# Altium schematic sheet Logica_ADC.SchDoc: CSN Detector V3
size A4; CheckedBy: RCP; Author: RCP; DrawnBy: RCP; Address1: LIM-HGGM; Address3: RCP; DocumentNumber: 1; Revision: 1; SheetNumber: 3; SheetTotal: 3; PageSetup: Record=PageOptions|CenterHorizontal=True|CenterVertical=True|PrintScale=1.00|XCorrection=1.00|YCorrection=1.00|PrintKind=0|BorderSize=5000000|LeftOffset=0|BottomOffset=0|Orientation=2|PaperLength=1000|PaperWidth=1000|Scale=100|PaperSource=7|PrintQuality=-4|MediaType=1|DitherType=10|PaperKind=A4|PrintScaleMode=1
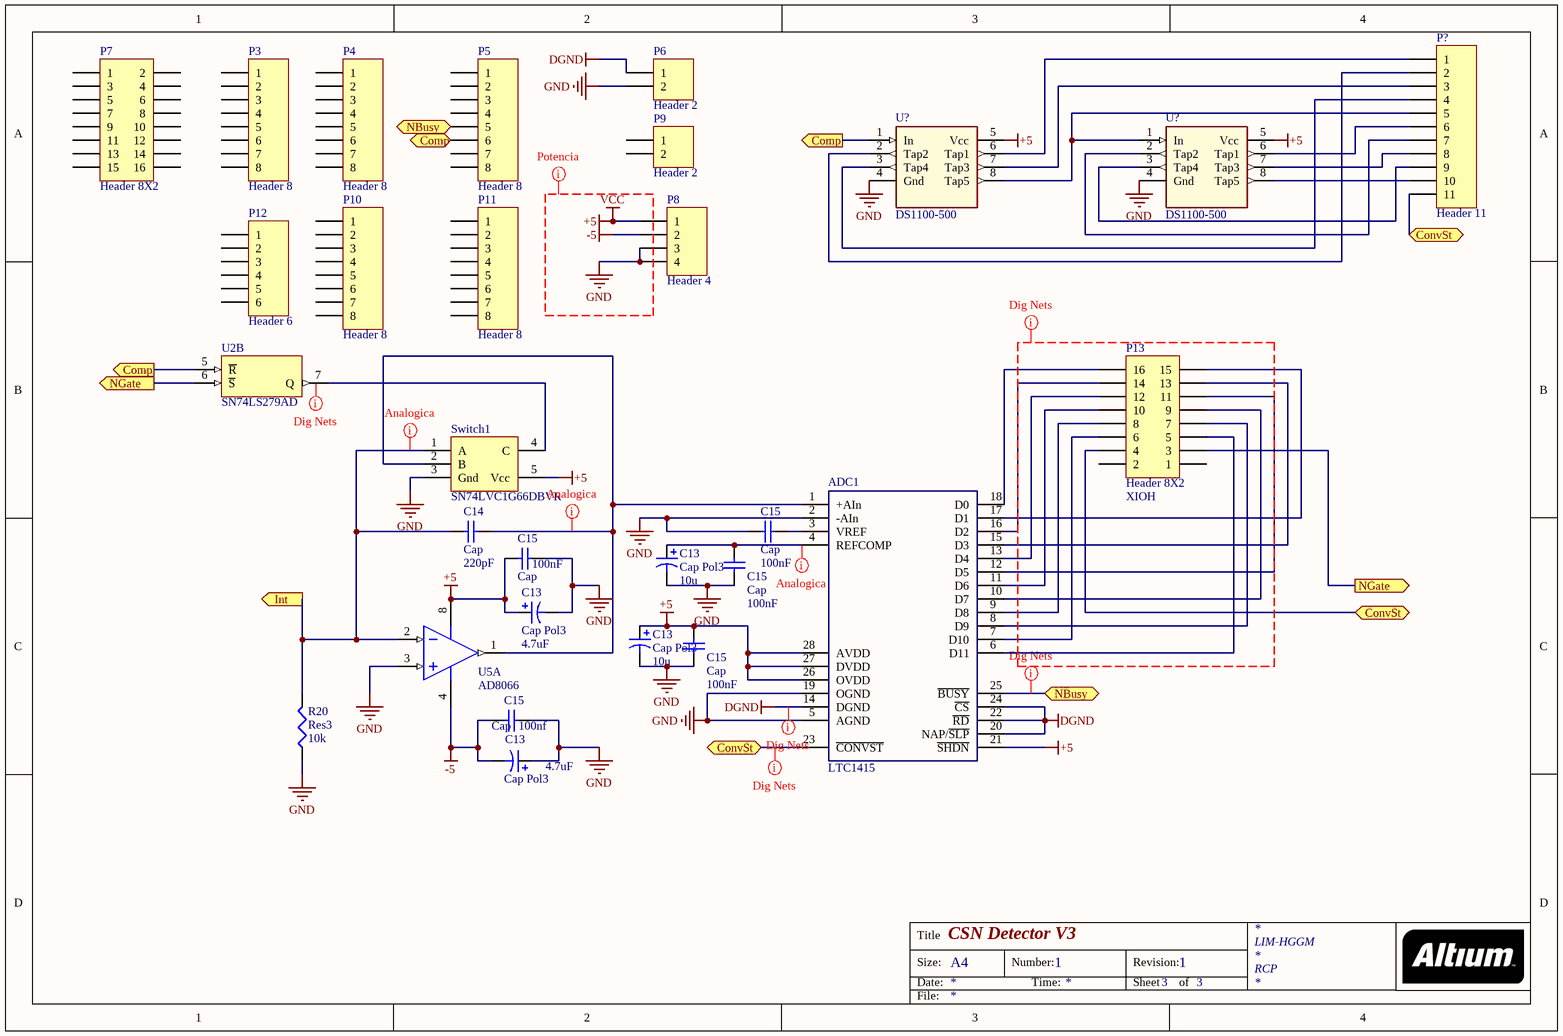
[diagram p0: Logica_ADC.SchDoc]

## Parts
(Parts that share a designator on the sheet are numbered #1, #2 ... from top to bottom, then left to right.)
ADC1  LTC1415  [SO28_N]
C13#1  Cap Pol3  value 10u  [C0805]
C13#2  Cap Pol3  value 4.7uF  [C0805]
C13#3  Cap Pol3  value 10u  [C0805]
C13#4  Cap Pol3  value 4.7uF  [C0805]
C14  Cap  value 220pF  [6-0805_N]
C15#1  Cap  value 100nF  [6-0805_N]
C15#2  Cap  value 100nF  [6-0805_N]
C15#3  Cap  value 100nF  [6-0805_N]
C15#4  Cap  value 100nF  [6-0805_N]
C15#5  Cap  value 100nf  [6-0805_N]
P3  Header 8  [HDR1X8]
P4  Header 8  [HDR1X8]
P5  Header 8  [HDR1X8]
P6  Header 2  [HDR1X2]
P7  Header 8X2  [HDR2X8]
P8  Header 4  [HDR1X4]
P9  Header 2  [HDR1X2]
P10  Header 8  [HDR1X8]
P11  Header 8  [HDR1X8]
P12  Header 6  [HDR1X6]
P13  Header 8X2  Con_Arduino: XIOH  [HDR2X8]
P?  Header 11  [HDR1X11]
R20  Res3  value 10k  [6-0805_N]
Switch1  SN74LVC1G66DBVR  [SOT23-5_N]
U2  SN74LS279AD  [D016_N]  (part B of 4)
U5  AD8066  [S8_N]  (part A of 2)
U?#1  DS1100-500  [SO-8_L]
U?#2  DS1100-500  [SO-8_L]

## Ports
Comp (out), ConvSt, Int (out), NBusy, NGate (out)

## Nets
+5: ADC1.21(~{SHDN}) ADC1.26(OVDD) ADC1.27(DVDD) ADC1.28(AVDD) C13#2.1 C13#3.1 C15#2.2 C15#4.2 P8.1 Switch1.5(Vcc) U2.16(VCC) U5.8(V+) U?#1.5(Vcc) U?#2.5(Vcc)  [also labelled VCC]
-5: C13#4.2 C15#5.1 P8.2 U5.4(V-)
DGND: ADC1.14(DGND) ADC1.20(NAP/~{SLP}) ADC1.22(~{RD}) ADC1.24(~{CS}) P6.1
GND: ADC1.2(-AIn) ADC1.5(AGND) ADC1.19(OGND) C13#1.2 C13#2.2 C13#3.2 C13#4.1 C15#1.2 C15#2.1 C15#3.1 C15#4.1 C15#5.2 P6.2 P8.3 P8.4 R20.1 Switch1.3(Gnd) U2.8(GND) U5.3(IN+) U?#1.4(Gnd) U?#2.4(Gnd)
Comp: P5.6 U2.5(~{R}) U?#1.1(In) ; port Comp
ConvSt: ADC1.23(~{CONVST}) P13.4 P?.11 ; port ConvSt
Int: C14.1 R20.2 Switch1.1(A) U5.2(IN-) ; port Int
NBusy: ADC1.25(~{BUSY}) P5.5 ; port NBusy
NGate: P13.3 U2.6(~{S}) ; port NGate
NetADC1_1: ADC1.1(+AIn) C14.2 Switch1.2(B) U5.1(OUT)
NetADC1_3: ADC1.3(VREF) C15#1.1
NetADC1_4: ADC1.4(REFCOMP) C13#1.1 C15#3.2
NetADC1_6: ADC1.6(D11) P13.5
NetADC1_7: ADC1.7(D10) P13.6
NetADC1_8: ADC1.8(D9) P13.7
NetADC1_9: ADC1.9(D8) P13.8
NetADC1_10: ADC1.10(D7) P13.9
NetADC1_11: ADC1.11(D6) P13.10
NetADC1_12: ADC1.12(D5) P13.11
NetADC1_13: ADC1.13(D4) P13.12
NetADC1_15: ADC1.15(D3) P13.13
NetADC1_16: ADC1.16(D2) P13.14
NetADC1_17: ADC1.17(D1) P13.15
NetADC1_18: ADC1.18(D0) P13.16
NetP?_1: P?.1 U?#1.6(Tap1)
NetP?_2: P?.2 U?#1.2(Tap2)
NetP?_3: P?.3 U?#1.7(Tap3)
NetP?_4: P?.4 U?#1.3(Tap4)
NetP?_5: P?.5 U?#1.8(Tap5) U?#2.1(In)
NetP?_6: P?.6 U?#2.6(Tap1)
NetP?_7: P?.7 U?#2.2(Tap2)
NetP?_8: P?.8 U?#2.7(Tap3)
NetP?_9: P?.9 U?#2.3(Tap4)
NetP?_10: P?.10 U?#2.8(Tap5)
NetSwitch1_4: Switch1.4(C) U2.7(Q)

Not connected (* = marked no-connect by the designer): P3 1 2 3 4 5 6 7 8; P4 1 2 3 4 5 6 7 8; P5 1 2 3 4 7 8; P7 1 2 3 4 5 6 7 8 9 10 11 12 13 14 15 16; P9 1 2; P10 1 2 3 4 5 6 7 8; P11 1 2 3 4 5 6 7 8; P12 1 2 3 4 5 6; P13 1 2

## Layout directives
net class digital: (no net found under the mark), ConvSt, DGND, NBusy
net class potencia: +5, -5, GND, VCC
net class analog: Int, NetADC1_1, NetADC1_4

## Notes on the sheet
- Title
- Size:
- Date:
- A4
- Number:
- Time:
- Revision:
- Sheet
- of
- File:

## Library data of the parts
C13#1-C13#4 = Cap Pol3: Polarized Capacitor (Surface Mount); Published: 8-Jun-2000; LatestRevisionDate: 29-May-2009; LatestRevisionNote: IPC-7351 Footprint Added.; PackageReference: C0805; Publisher: Altium Limited; PackageDescription: Chip Capacitor
C14 C15#1-C15#5 = Cap: Capacitor; Published: 8-Jun-2000; LatestRevisionDate: 17-Jul-2002; LatestRevisionNote: Re-released for DXP Platform.; PackageReference: RAD-0.3; Publisher: Altium Limited; PackageDescription: Radial Cap, Thru-Hole; 2 Leads; 0.3 in Pin Spacing
P3-P5 P10 P11 = Header 8: Header, 8-Pin; LatestRevisionDate: 17-Jul-2002; LatestRevisionNote: Re-released for DXP Platform.; Publisher: Altium Limited
P6 P9 = Header 2: Header, 2-Pin; LatestRevisionDate: 17-Jul-2002; LatestRevisionNote: Re-released for DXP Platform.; Publisher: Altium Limited
P7 P13 = Header 8X2: Header, 8-Pin, Dual row; LatestRevisionDate: 17-Jul-2002; LatestRevisionNote: Re-released for DXP Platform.; Publisher: Altium Limited
P8 = Header 4: Header, 4-Pin; LatestRevisionDate: 17-Jul-2002; LatestRevisionNote: Re-released for DXP Platform.; Publisher: Altium Limited
P12 = Header 6: Header, 6-Pin; LatestRevisionDate: 17-Jul-2002; LatestRevisionNote: Re-released for DXP Platform.; Publisher: Altium Limited
P? = Header 11: Header, 11-Pin; LatestRevisionDate: 17-Jul-2002; LatestRevisionNote: Re-released for DXP Platform.; Publisher: Altium Limited
R20 = Res3: Resistor; Published: 8-Jun-2000; LatestRevisionDate: 29-May-2009; LatestRevisionNote: IPC-7351 Footprint Added.; PackageReference: J1-0603; Publisher: Altium Limited; PackageDescription: Chip Resistor
U2 = SN74LS279AD: Quadruple S-R Latches; Published: 8-Jun-2000; LatestRevisionDate: 13-Apr-2006; LatestRevisionNote: IPC-7351 Footprint Added.; DatasheetVersion: Mar-1988; PackageVersion: Jan-1998; PackageReference: D016; Publisher: Altium Limited; PackageDescription: 16-Pin Small Outline Integrated Circuit 1.27 mm Pitch; Code_IPC: SOIC127P600-16; ComponentLink1Description: Manufacturer Link; ComponentLink1URL: http://www.ti.com/; ComponentLink2Description: Datasheet; ComponentLink2URL: http://www-s.ti.com/sc/ds/sn54279.pdf
U5 = LT1253CS8: Low Cost Dual Video Amplifier; Note: 1003; Published: 8-Jun-2000; LatestRevisionDate: 13-Apr-2006; LatestRevisionNote: IPC-7351 Footprint Added.; DatasheetVersion: 1996; PackageReference: S8; Publisher: Altium Limited; PackageDescription: 8-Pin Small Outline Integrated Circuit 1.27 mm Pitch; Code_JEDEC: MS-012-AA; Code_IPC: SOIC127P600-8; ComponentLink1Description: Manufacturer Link; ComponentLink1URL: http://www.linear.com/; ComponentLink2Description: Datasheet; ComponentLink2URL: http://www.linear.com/pc/downloadDocument.do?navId=H0,C1,C1154,C1009,C1022,P1423,D1129